# Altium schematic sheet Mocromouse.SchDoc
size A4; DrawnBy: Rajesh Jasti; DocumentNumber: 1; SheetNumber: 1; SheetTotal: 1
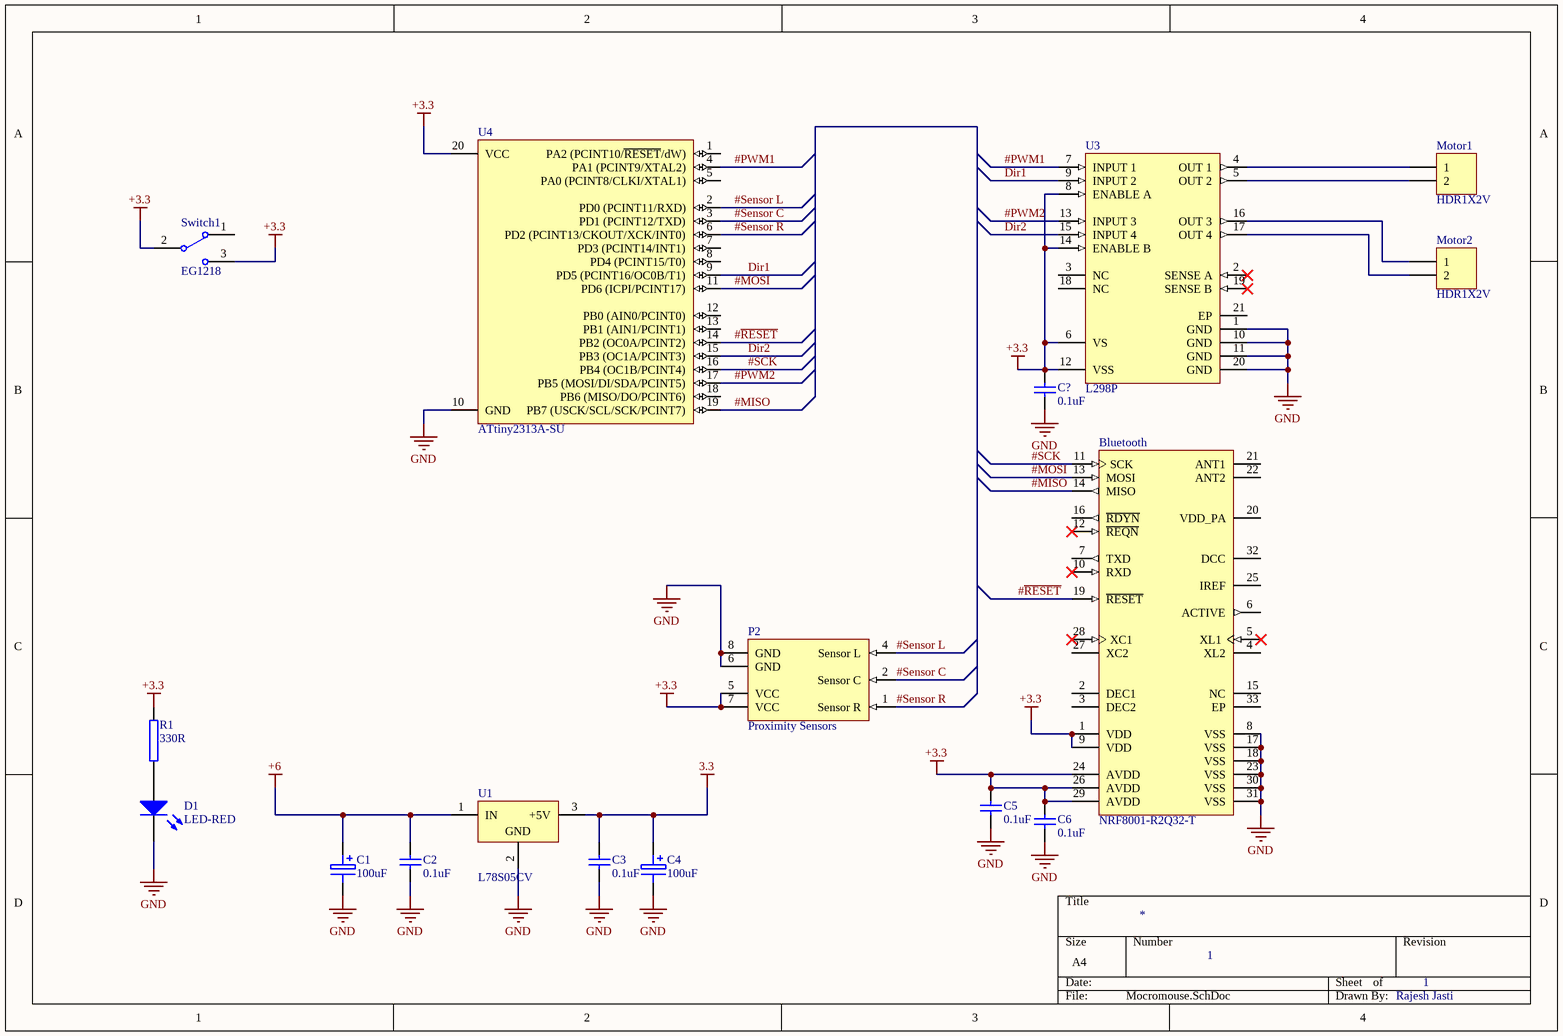
[diagram p0: Mocromouse.SchDoc]

## Parts
Bluetooth  NRF8001-R2Q32-T  [NRSC-QFN-32_M]
C1  100uF  [CAPP150-300_AUT]
C2  0.1uF  [RAD-0.1_AUT]
C3  0.1uF  [RAD-0.1_AUT]
C4  100uF  [CAPP150-300_AUT]
C5  0.1uF  [RAD-0.1_AUT]
C6  0.1uF  [RAD-0.1_AUT]
C?  0.1uF  [RAD-0.1_AUT]
D1  LED-RED  [LED3MM_R_AUT]
Motor1  HDR1X2V  [HDR1X2_AUT]
Motor2  HDR1X2V  [HDR1X2_AUT]
P2  Proximity Sensors  [Line Folloing Board]
R1  330R  [AXIAL-0.4AUT]
Switch1  EG1218  [ESWI-EG1218_V]
U1  L78S05CV  [TO-220H]
U3  L298P  [STM-PowerSO20_M]
U4  ATtiny2313A-SU  [20S_M]

## Nets
3.3: C3.2 C4.1 U1.3(+5V)
+3.3: Bluetooth.1(VDD) Bluetooth.9(VDD) Bluetooth.24(AVDD) Bluetooth.26(AVDD) Bluetooth.29(AVDD) C5.2 C6.2 C?.2 P2.5(VCC) P2.7(VCC) R1.2 Switch1.2(COM) Switch1.3 U3.6(VS) U3.8(ENABLE_A) U3.12(VSS) U3.14(ENABLE_B) U4.20(VCC)
+6: C1.1 C2.2 U1.1(IN)
GND: Bluetooth.8(VSS) Bluetooth.17(VSS) Bluetooth.18(VSS) Bluetooth.23(VSS) Bluetooth.30(VSS) Bluetooth.31(VSS) C1.2 C2.1 C3.1 C4.2 C5.1 C6.1 C?.1 D1.K P2.6(GND) P2.8(GND) U1.2(GND) U3.1(GND) U3.10(GND) U3.11(GND) U3.20(GND) U4.10(GND)
#MISO: Bluetooth.14(MISO) U4.19(PB7_(USCK/SCL/SCK/PCINT7))
#MOSI: Bluetooth.13(MOSI) U4.11(PD6_(ICPI/PCINT17))
#PWM1: U3.7(INPUT_1) U4.4(PA1_(PCINT9/XTAL2))
#PWM2: U3.13(INPUT_3) U4.17(PB5_(MOSI/DI/SDA/PCINT5))
#~{RESET}: Bluetooth.19(~{RESET}) U4.14(PB2_(OC0A/PCINT2))
#SCK: Bluetooth.11(SCK) U4.16(PB4_(OC1B/PCINT4))
#Sensor C: P2.2(Sensor_C) U4.3(PD1_(PCINT12/TXD))
#Sensor L: P2.4(Sensor_L) U4.2(PD0_(PCINT11/RXD))
#Sensor R: P2.1(Sensor_R) U4.6(PD2_(PCINT13/CKOUT/XCK/INT0))
Dir1: U3.9(INPUT_2) U4.9(PD5_(PCINT16/OC0B/T1))
Dir2: U3.15(INPUT_4) U4.15(PB3_(OC1A/PCINT3))
NetD1_A: D1.A R1.1
NetMotor1_1: Motor1.1 U3.4(OUT_1)
NetMotor1_2: Motor1.2 U3.5(OUT_2)
NetMotor2_1: Motor2.1 U3.16(OUT_3)
NetMotor2_2: Motor2.2 U3.17(OUT_4)

Not connected (* = marked no-connect by the designer): Bluetooth 2(DEC1) 3(DEC2) 4(XL2) 5(XL1)* 6(ACTIVE) 7(TXD) 10(RXD)* 12(~{REQN})* 15(NC) 16(~{RDYN}) 20(VDD_PA) 21(ANT1) 22(ANT2) 25(IREF) 27(XC2) 28(XC1)* 32(DCC) 33(EP); P2 3(NC); Switch1 1; U3 2(SENSE_A)* 3(NC) 18(NC) 19(SENSE_B)* 21(EP); U4 1(PA2_(PCINT10/~{RESET}/dW)) 5(PA0_(PCINT8/CLKI/XTAL1)) 7(PD3_(PCINT14/INT1)) 8(PD4_(PCINT15/T0)) 12(PB0_(AIN0/PCINT0)) 13(PB1_(AIN1/PCINT1)) 18(PB6_(MISO/DO/PCINT6))

## Library data of the parts
Bluetooth = CMP-021-00005-1: Single-Chip Bluetooth(R) Low Energy Solution, 1.9 to 3.6 V, -40 to 85 degC, 32-Pin QFN, RoHS, Tray; Manufacturer: Nordic Semiconductor; Nominal Supply Voltage: 3V; Min Supply Voltage: 1.9V; Data Rate: 1Mbps; Max Supply Voltage: 3.6V; Packaging: Tray; Case/Package: QFN; Max Operating Temperature: 85°C; Pins: 32; Package Reference: QFN-32; Mounting Technology: SM; Manufacturer URL: http://www.nordicsemi.com/eng/Products/; Datasheet Version: Rev. 1.1, 10/2012; Package Quantity: 490; RoHS Compliant: True; Min Operating Temperature: -40°C; Package Description: 32-Pin Quad Flat No-lead Package, Body 5 x 5 mm, Pitch 0.5 mm; Datasheet URL: https://datasheet.ciiva.com/4914/nrf8001-ps-v-1-1-2797-4914162.pdf
C1 C4 = CAPP150-300: Polarized Aluminum Capacitor, Through Hole, Pitch 150mil, Body 300mil (Dia)
C2 C3 C5 C6 C? = CAPN RAD0.1: Non Polarized Capacitor, Multilayer Ceramic Dipped Radial, Pitch 100mil
D1 = 3mm LED-RED: 3mm RED LED, Through Hole; Supplier 1: Farnell; Supplier Part Number 1: 1003207
Motor1 Motor2 = HDR1X2V: Header, Plug, 2.54mm, 2 Pins, Straight; Supplier 1: Farnell; Supplier Part Number 1: 2254030
P2 = Line Following Board: Connectors for Line Followinf Board; Supplier 1: Mouser; Supplier Part Number 1: 200-SSW10201FD
R1 = Resistor 1/4W: Resistor, Through Hole, Pitch 400mil
Switch1 = CMP-011-00006-1: Slide Switch, SPDT, 500 V, -20 to 70 degC, 3-Pin THD, RoHS, Bulk; Manufacturer: E-Switch; Operating Force: 250gf; Contact Current Rating: 200mA; Current Rating: 2dA; Voltage Rating (DC): 30V; Packaging: Bulk; Max Operating Temperature: 70°C; Contact Material: Copper; Datasheet URL: https://www.e-switch.com/system/asset/product_line/data_sheet/119/EG.pdf; Case/Package: EG1218; Min Operating Temperature: -20°C; Pins: 3; Throw Configuration: SPDT; Package Description: 3-Pin Through Hole Device, Body 11.6 x 4 mm, Pitch 2.5 mm; Voltage Rating (AC): 30V; Package Reference: EG1218; Datasheet Version: Oct-15; Package Quantity: 1000; Mounting Technology: TH; RoHS Compliant: True; Manufacturer URL: http://www.e-switch.ch/en/; Contact Plating: Silver; Contact Finish: Silver
U1 = L78S05CV: 5V, 2A, LDO, TO-220-3; Supplier 1: Farnell; Supplier Part Number 1: 9756086
U3 = CMP-00024-00000-1: Dual Full-Bridge Driver, 4.5 to 7 V, -25 to 130 degC, 20-Pin SOIC, RoHS, Tube; Manufacturer: STMicroelectronics; Max Supply Voltage: 46V; Output Current: 2A; Outputs: 4; Nominal Supply Voltage: 42V; Min Supply Voltage: 4.8V; Datasheet Version: Jan-00; Datasheet URL: http://www.st.com/content/ccc/resource/technical/document/datasheet/82/cc/3f/39/0a/29/4d/f0/CD00000240.pdf/files/CD00000240.pdf/jcr:content/translations/en.CD00000240.pdf; Mounting Technology: SM; Package Quantity: 31; Package Description: 20-Pin Small Outline Integrated Circuits, Body 15.9 x 11 mm, Pitch 1.27 mm; RoHS Compliant: True; Manufacturer URL: http://www.st.com/; Package Reference: PowerSO20; Pins: 20; Packaging: Rail/Tube; Case/Package: SOIC; Min Operating Temperature: -25°C; Max Operating Temperature: 130°C
U4 = ATtiny2313A-SU: 8-bit AVR Microcontroller, 1.8-5.5V, 2KB Flash, 128 Bytes EEPROM, 128 Bytes SRAM; Supplier 1: Farnell; Supplier Part Number 1: 2446406